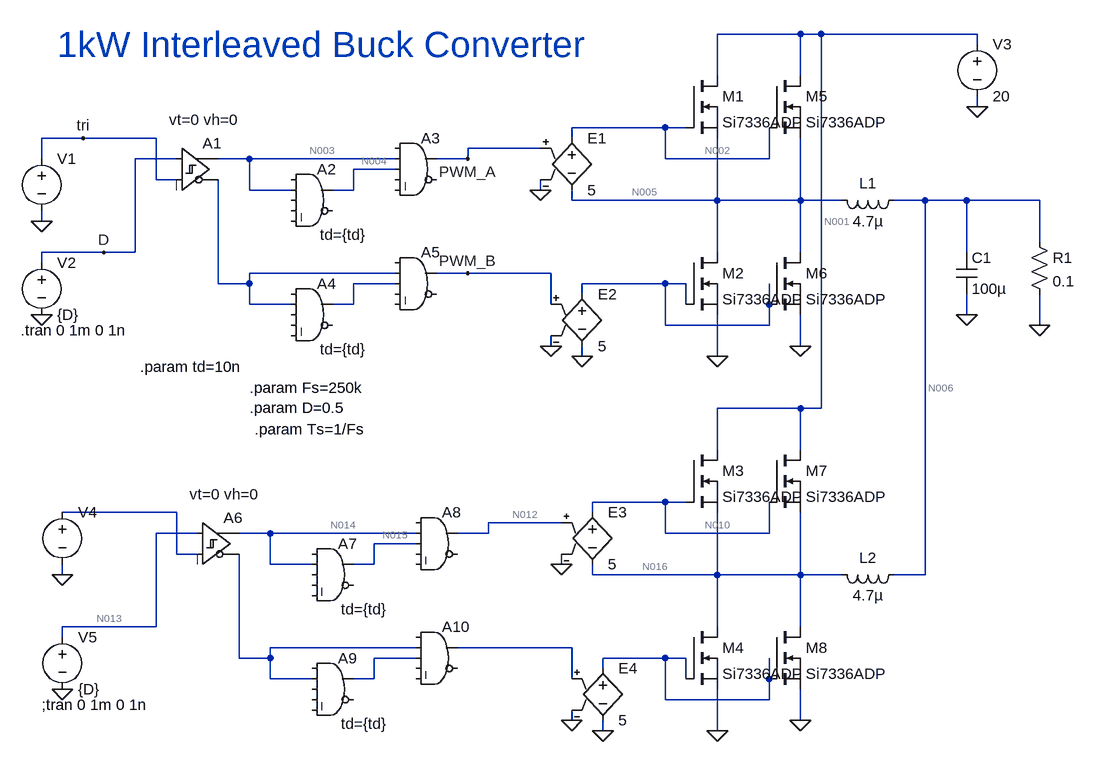
[diagram p0: schematic 1kWInterleavedBuckConverter.asc]
1kWInterleavedBuckConverter.asc, the LTspice schematic file:
Version 4
SHEET 1 1648 1044
WIRE 1104 -64 976 -64
WIRE 1136 -64 1104 -64
WIRE 1376 -64 1136 -64
WIRE 1376 -48 1376 -64
WIRE 976 0 976 -64
WIRE 1104 0 1104 -64
WIRE 1376 48 1376 32
WIRE 896 80 752 80
WIRE 928 80 896 80
WIRE 0 96 -64 96
WIRE 112 96 0 96
WIRE 752 96 752 80
WIRE 704 112 592 112
WIRE -64 128 -64 96
WIRE 144 128 80 128
WIRE 256 128 208 128
WIRE 480 128 256 128
WIRE 592 128 592 112
WIRE 592 128 544 128
WIRE 896 128 896 80
WIRE 1056 128 1056 80
WIRE 1056 128 896 128
WIRE 480 144 416 144
WIRE 112 160 112 96
WIRE 144 160 112 160
WIRE 256 176 256 128
WIRE 320 176 256 176
WIRE 416 176 416 144
WIRE 416 176 384 176
WIRE 704 176 704 160
WIRE 752 192 752 176
WIRE 976 192 976 96
WIRE 976 192 752 192
WIRE 1104 192 1104 96
WIRE 1104 192 976 192
WIRE 1168 192 1104 192
WIRE 1296 192 1248 192
WIRE 1360 192 1296 192
WIRE 1472 192 1360 192
WIRE -64 224 -64 208
WIRE 1472 256 1472 192
WIRE 32 272 -64 272
WIRE 80 272 80 128
WIRE 80 272 32 272
WIRE 976 272 976 192
WIRE 1104 272 1104 192
WIRE 1360 272 1360 192
WIRE -64 288 -64 272
WIRE 480 304 256 304
WIRE 592 304 544 304
WIRE 720 304 592 304
WIRE 208 320 208 160
WIRE 256 320 256 304
WIRE 256 320 208 320
WIRE 480 320 416 320
WIRE 896 320 768 320
WIRE 928 320 896 320
WIRE 768 336 768 320
WIRE 256 352 256 320
WIRE 320 352 256 352
WIRE 416 352 416 320
WIRE 416 352 384 352
WIRE 720 352 720 304
WIRE 928 352 928 320
WIRE 1056 352 1056 320
WIRE 1360 368 1360 336
WIRE 896 384 896 320
WIRE 1056 384 1056 352
WIRE 1056 384 896 384
WIRE 1472 384 1472 336
WIRE 720 416 720 400
WIRE 1104 416 1104 368
WIRE 768 432 768 416
WIRE 976 432 976 368
WIRE 1104 512 976 512
WIRE 1136 512 1136 -64
WIRE 1136 512 1104 512
WIRE 976 576 976 512
WIRE 1104 576 1104 512
WIRE 896 656 784 656
WIRE 928 656 896 656
WIRE 144 672 -32 672
WIRE 784 672 784 656
WIRE 736 688 624 688
WIRE 176 704 112 704
WIRE 288 704 240 704
WIRE 512 704 288 704
WIRE 624 704 624 688
WIRE 624 704 576 704
WIRE 896 704 896 656
WIRE 1056 704 1056 656
WIRE 1056 704 896 704
WIRE 512 720 448 720
WIRE 144 736 144 672
WIRE 176 736 144 736
WIRE 288 752 288 704
WIRE 352 752 288 752
WIRE 448 752 448 720
WIRE 448 752 416 752
WIRE 736 752 736 736
WIRE -32 768 -32 752
WIRE 784 768 784 752
WIRE 976 768 976 672
WIRE 976 768 784 768
WIRE 1104 768 1104 672
WIRE 1104 768 976 768
WIRE 1168 768 1104 768
WIRE 1296 768 1296 192
WIRE 1296 768 1248 768
WIRE 112 848 112 704
WIRE 112 848 -32 848
WIRE 976 848 976 768
WIRE 1104 848 1104 768
WIRE -32 864 -32 848
WIRE 512 880 288 880
WIRE 752 880 576 880
WIRE 240 896 240 736
WIRE 288 896 288 880
WIRE 288 896 240 896
WIRE 512 896 448 896
WIRE 896 896 800 896
WIRE 928 896 896 896
WIRE 800 912 800 896
WIRE 288 928 288 896
WIRE 352 928 288 928
WIRE 448 928 448 896
WIRE 448 928 416 928
WIRE 752 928 752 880
WIRE 928 928 928 896
WIRE 1056 928 1056 896
WIRE 896 960 896 896
WIRE 1056 960 1056 928
WIRE 1056 960 896 960
WIRE 752 992 752 976
WIRE 1104 992 1104 944
WIRE 800 1008 800 992
WIRE 976 1008 976 944
FLAG -64 224 0
FLAG 0 96 tri
FLAG -64 368 0
FLAG 32 272 D
FLAG 592 128 PWM_A
FLAG 592 304 PWM_B
FLAG 976 432 0
FLAG 1360 368 0
FLAG 1472 384 0
FLAG 1376 48 0
FLAG 704 176 0
FLAG 720 416 0
FLAG 768 432 0
FLAG 1104 416 0
FLAG 976 1008 0
FLAG 1104 992 0
FLAG -32 944 0
FLAG 736 752 0
FLAG 752 992 0
FLAG 800 1008 0
FLAG -32 768 0
SYMBOL voltage -64 112 R0
WINDOW 3 24 96 Invisible 2
WINDOW 123 0 0 Left 0
WINDOW 39 0 0 Left 0
SYMATTR Value PULSE(0 1 0 {1/(2*Fs)} {1/(2*Fs)} 1n {1/(Fs)})
SYMATTR InstName V1
SYMBOL voltage -64 272 R0
SYMATTR InstName V2
SYMATTR Value {D}
SYMBOL Digital\\diffschmitt 144 80 R0
WINDOW 3 -12 -12 Left 2
SYMATTR Value vt=0 vh=0
SYMATTR InstName A1
SYMBOL Digital\\and 352 128 R0
WINDOW 3 13 117 Left 2
SYMATTR Value td={td}
SYMATTR InstName A2
SYMBOL Digital\\and 512 80 R0
SYMATTR InstName A3
SYMBOL Digital\\and 352 304 R0
WINDOW 3 13 117 Left 2
SYMATTR Value td={td}
SYMATTR InstName A4
SYMBOL Digital\\and 512 256 R0
SYMATTR InstName A5
SYMBOL nmos 928 0 R0
SYMATTR InstName M1
SYMATTR Value Si7336ADP
SYMBOL nmos 928 272 R0
SYMATTR InstName M2
SYMATTR Value Si7336ADP
SYMBOL ind 1264 176 R90
WINDOW 0 5 56 VBottom 2
WINDOW 3 32 56 VTop 2
SYMATTR InstName L1
SYMATTR Value 4.7µ
SYMBOL cap 1344 272 R0
SYMATTR InstName C1
SYMATTR Value 100µ
SYMBOL res 1456 240 R0
SYMATTR InstName R1
SYMATTR Value 0.1
SYMBOL voltage 1376 -64 R0
SYMATTR InstName V3
SYMATTR Value 20
SYMBOL e 752 80 R0
SYMATTR InstName E1
SYMATTR Value 5
SYMBOL e 768 320 R0
SYMATTR InstName E2
SYMATTR Value 5
SYMBOL nmos 1056 0 R0
SYMATTR InstName M5
SYMATTR Value Si7336ADP
SYMBOL nmos 1056 272 R0
SYMATTR InstName M6
SYMATTR Value Si7336ADP
SYMBOL nmos 928 576 R0
SYMATTR InstName M3
SYMATTR Value Si7336ADP
SYMBOL nmos 928 848 R0
SYMATTR InstName M4
SYMATTR Value Si7336ADP
SYMBOL ind 1264 752 R90
WINDOW 0 5 56 VBottom 2
WINDOW 3 32 56 VTop 2
SYMATTR InstName L2
SYMATTR Value 4.7µ
SYMBOL nmos 1056 576 R0
SYMATTR InstName M7
SYMATTR Value Si7336ADP
SYMBOL nmos 1056 848 R0
SYMATTR InstName M8
SYMATTR Value Si7336ADP
SYMBOL voltage -32 848 R0
SYMATTR InstName V5
SYMATTR Value {D}
SYMBOL Digital\\diffschmitt 176 656 R0
WINDOW 3 -12 -12 Left 2
SYMATTR Value vt=0 vh=0
SYMATTR InstName A6
SYMBOL Digital\\and 384 704 R0
WINDOW 3 13 117 Left 2
SYMATTR Value td={td}
SYMATTR InstName A7
SYMBOL Digital\\and 544 656 R0
SYMATTR InstName A8
SYMBOL Digital\\and 384 880 R0
WINDOW 3 13 117 Left 2
SYMATTR Value td={td}
SYMATTR InstName A9
SYMBOL Digital\\and 544 832 R0
SYMATTR InstName A10
SYMBOL e 784 656 R0
SYMATTR InstName E3
SYMATTR Value 5
SYMBOL e 800 896 R0
SYMATTR InstName E4
SYMATTR Value 5
SYMBOL voltage -32 656 R0
WINDOW 3 24 96 Invisible 2
WINDOW 123 0 0 Left 0
WINDOW 39 0 0 Left 0
SYMATTR Value PULSE(0 1 {Ts/2} {1/(2*Fs)} {1/(2*Fs)} 1n {1/(Fs)})
SYMATTR InstName V4
TEXT 256 480 Left 2 !.param Fs=250k\n.param D=0.5
TEXT 88 448 Left 2 !.param td=10n
TEXT -96 392 Left 2 !.tran 0 1m 0 1n
TEXT -40 -48 Left 5 ;1kW Interleaved Buck Converter
TEXT -64 968 Left 2 !;tran 0 1m 0 1n
TEXT 264 544 Left 2 !.param Ts=1/Fs

The netlist it stands for:
* 1kWInterleavedBuckConverter.asc
V1 tri 0 PULSE(0 1 0 {1/(2*Fs)} {1/(2*Fs)} 1n {1/(Fs)})
V2 D 0 {D}
A1 D tri 0 0 0 N007 N003 0 SCHMITT vt=0 vh=0
A2 0 N003 0 0 0 0 N004 0 AND td={td}
A3 0 N003 N004 0 0 0 PWM_A 0 AND
A4 0 N007 0 0 0 0 N008 0 AND td={td}
A5 0 N007 N008 0 0 0 PWM_B 0 AND
M1 N001 N002 N005 N005 Si7336ADP
M2 N005 N009 0 0 Si7336ADP
L1 N006 N005 4.7µ
C1 N006 0 100µ
R1 N006 0 0.1
V3 N001 0 20
E1 N002 N005 PWM_A 0 5
E2 N009 0 PWM_B 0 5
M5 N001 N002 N005 N005 Si7336ADP
M6 N005 N009 0 0 Si7336ADP
M3 N001 N010 N016 N016 Si7336ADP
M4 N016 N020 0 0 Si7336ADP
L2 N006 N016 4.7µ
M7 N001 N010 N016 N016 Si7336ADP
M8 N016 N020 0 0 Si7336ADP
V5 N013 0 {D}
A6 N013 N011 0 0 0 N017 N014 0 SCHMITT vt=0 vh=0
A7 0 N014 0 0 0 0 N015 0 AND td={td}
A8 0 N014 N015 0 0 0 N012 0 AND
A9 0 N017 0 0 0 0 N019 0 AND td={td}
A10 0 N017 N019 0 0 0 N018 0 AND
E3 N010 N016 N012 0 5
E4 N020 0 N018 0 5
V4 N011 0 PULSE(0 1 {Ts/2} {1/(2*Fs)} {1/(2*Fs)} 1n {1/(Fs)})
.model NMOS NMOS
.model PMOS PMOS
.lib standard.mos
.param Fs=250k
.param D=0.5
.param td=10n
.tran 0 1m 0 1n
* 1kW Interleaved Buck Converter
;tran 0 1m 0 1n
.param Ts=1/Fs
.backanno
.end

* Results of the author's LTspice run, read from the files saved beside the schematic
* Operating Point, zero values left out:
*   V(d) = 500 mV
*   V(n003) = 1 V
*   V(n004) = 1 V
*   V(n002) = 24.86 V
*   V(n006) = 19.76 V
*   V(n016) = 19.86 V
*   V(n014) = 1 V
*   V(pwm_a) = 1 V
*   V(n001) = 20 V
*   V(n005) = 19.86 V
*   V(n010) = 24.86 V
*   V(n013) = 500 mV
*   V(n015) = 1 V
*   V(n012) = 1 V
*   I(E1) = 7.276 pA
*   Id(M4) = 24.87 pA
*   Is(M4) = -24.87 pA
*   Id(M5) = 49.39 A
*   Is(M5) = -49.39 A
*   Id(M7) = 49.39 A
*   Is(M7) = -49.39 A
*   Id(M1) = 49.39 A
*   Is(M1) = -49.39 A
*   I(E3) = 1.819 pA
*   I(V3) = -197.6 A
*   I(L1) = -98.78 A
*   I(L2) = -98.78 A
*   Id(M3) = 49.39 A
*   Is(M3) = -49.39 A
*   Id(M8) = 24.87 pA
*   Is(M8) = -24.87 pA
*   Id(M6) = 24.87 pA
*   Is(M6) = -24.87 pA
*   Id(M2) = 24.87 pA
*   Is(M2) = -24.87 pA
*   I(R1) = 197.6 A